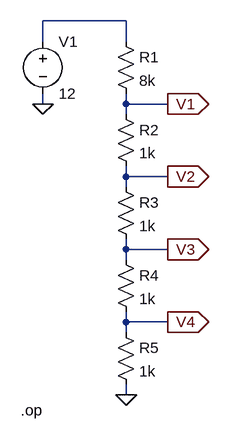
[diagram p0: schematic 12V_Div_1V.asc]
12V_Div_1V.asc, the LTspice schematic file:
Version 4
SHEET 1 880 684
WIRE 144 32 16 32
WIRE 16 64 16 32
WIRE 144 64 144 32
WIRE 16 160 16 144
WIRE 144 160 144 144
WIRE 208 160 144 160
WIRE 144 176 144 160
WIRE 144 272 144 256
WIRE 208 272 144 272
WIRE 144 288 144 272
WIRE 144 384 144 368
WIRE 208 384 144 384
WIRE 144 400 144 384
WIRE 144 496 144 480
WIRE 208 496 144 496
WIRE 144 512 144 496
WIRE 144 608 144 592
FLAG 144 608 0
FLAG 16 160 0
FLAG 208 160 V1
IOPIN 208 160 Out
FLAG 208 272 V2
IOPIN 208 272 Out
FLAG 208 384 V3
IOPIN 208 384 Out
FLAG 208 496 V4
IOPIN 208 496 Out
SYMBOL res 128 48 R0
SYMATTR InstName R1
SYMATTR Value 8k
SYMBOL res 128 160 R0
SYMATTR InstName R2
SYMATTR Value 1k
SYMBOL res 128 272 R0
SYMATTR InstName R3
SYMATTR Value 1k
SYMBOL res 128 384 R0
SYMATTR InstName R4
SYMATTR Value 1k
SYMBOL res 128 496 R0
SYMATTR InstName R5
SYMATTR Value 1k
SYMBOL voltage 16 48 R0
WINDOW 123 0 0 Left 0
WINDOW 39 0 0 Left 0
SYMATTR InstName V1
SYMATTR Value 12
TEXT -18 632 Left 2 !.op

The netlist it stands for:
* 12V_Div_1V.asc
R1 N001 V1 8k
R2 V1 V2 1k
R3 V2 V3 1k
R4 V3 V4 1k
R5 V4 0 1k
V1 N001 0 12
.op
.backanno
.end